# Altium schematic sheet Public_SOC.SchDoc
size Tabloid
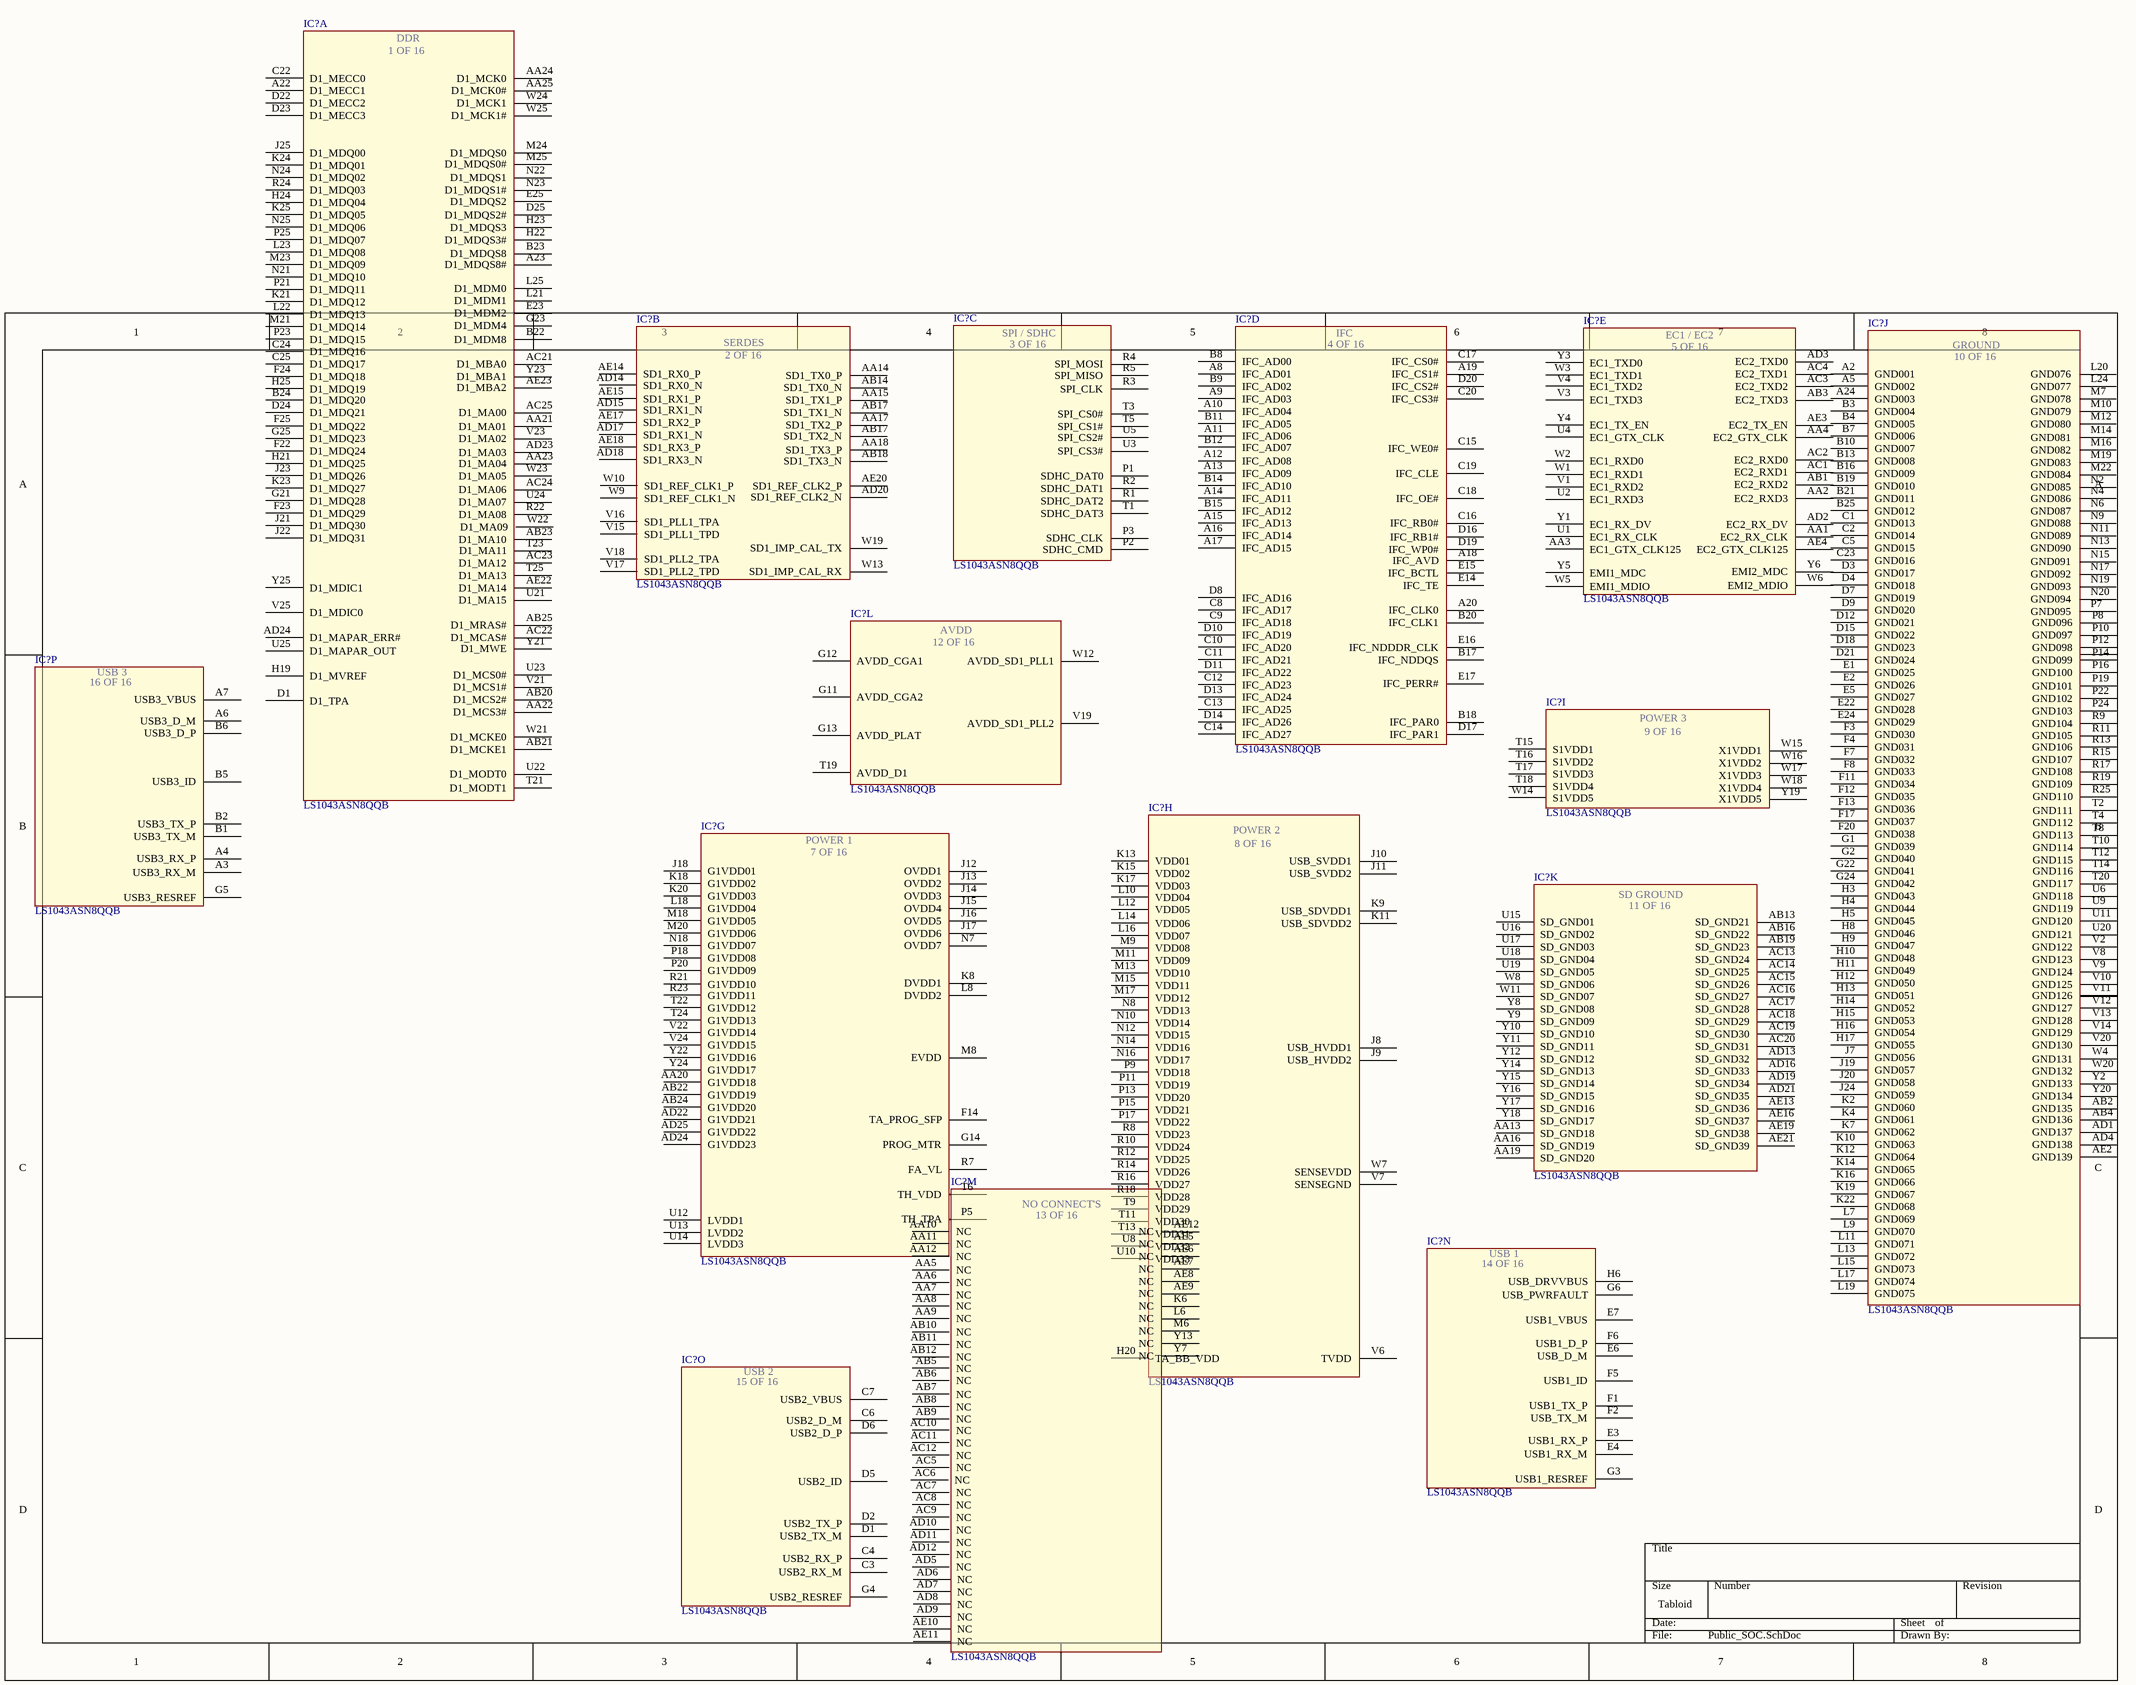
[diagram p0: Public_SOC.SchDoc]

## Parts
(Parts that share a designator on the sheet are numbered #1, #2 ... from top to bottom, then left to right.)
IC?#1  LS1043ASN8QQB  [BGA780C80P28X28_2300X2300X261]  (part E of 16)
IC?#2  LS1043ASN8QQB  [BGA780C80P28X28_2300X2300X261]  (part D of 16)
IC?#3  LS1043ASN8QQB  [BGA780C80P28X28_2300X2300X261]  (part L of 16)
IC?#4  LS1043ASN8QQB  [BGA780C80P28X28_2300X2300X261]  (part C of 16)
IC?#5  LS1043ASN8QQB  [BGA780C80P28X28_2300X2300X261]  (part I of 16)
IC?#6  LS1043ASN8QQB  [BGA780C80P28X28_2300X2300X261]  (part P of 16)
IC?#7  LS1043ASN8QQB  [BGA780C80P28X28_2300X2300X261]  (part K of 16)
IC?#8  LS1043ASN8QQB  [BGA780C80P28X28_2300X2300X261]  (part J of 16)
IC?#9  LS1043ASN8QQB  [BGA780C80P28X28_2300X2300X261]  (part A of 16)
IC?#10  LS1043ASN8QQB  [BGA780C80P28X28_2300X2300X261]  (part B of 16)
IC?#11  LS1043ASN8QQB  [BGA780C80P28X28_2300X2300X261]  (part G of 16)
IC?#12  LS1043ASN8QQB  [BGA780C80P28X28_2300X2300X261]  (part O of 16)
IC?#13  LS1043ASN8QQB  [BGA780C80P28X28_2300X2300X261]  (part H of 16)
IC?#14  LS1043ASN8QQB  [BGA780C80P28X28_2300X2300X261]  (part N of 16)
IC?#15  LS1043ASN8QQB  [BGA780C80P28X28_2300X2300X261]  (part M of 16)

## Nets

Not connected (* = marked no-connect by the designer): IC?#1 AA1(EC2_RX_CLK) AA2(EC2_RXD3) AA3(EC1_GTX_CLK125) AA4(EC2_GTX_CLK) AB1(EC2_RXD2) AB3(EC2_TXD3) AC1(EC2_RXD1) AC2(EC2_RXD0) AC3(EC2_TXD2) AC4(EC2_TXD1) AD2(EC2_RX_DV) AD3(EC2_TXD0) AE3(EC2_TX_EN) AE4(EC2_GTX_CLK125) U1(EC1_RX_CLK) U2(EC1_RXD3) U4(EC1_GTX_CLK) V1(EC1_RXD2) V3(EC1_TXD3) V4(EC1_TXD2) W1(EC1_RXD1) W2(EC1_RXD0) W3(EC1_TXD1) W5(EMI1_MDIO) W6(EMI2_MDIO) Y1(EC1_RX_DV) Y3(EC1_TXD0) Y4(EC1_TX_EN) Y5(EMI1_MDC) Y6(EMI2_MDC); IC?#2 A8(IFC_AD01) A9(IFC_AD03) A10(IFC_AD04) A11(IFC_AD06) A12(IFC_AD08) A13(IFC_AD09) A14(IFC_AD11) A15(IFC_AD13) A16(IFC_AD14) A17(IFC_AD15) A18(IFC_AVD) A19(IFC_CS1#) A20(IFC_CLK0) B8(IFC_AD00) B9(IFC_AD02) B11(IFC_AD05) B12(IFC_AD07) B14(IFC_AD10) B15(IFC_AD12) B17(IFC_NDDQS) B18(IFC_PAR0) B20(IFC_CLK1) C8(IFC_AD17) C9(IFC_AD18) C10(IFC_AD20) C11(IFC_AD21) C12(IFC_AD23) C13(IFC_AD25) C14(IFC_AD27) C15(IFC_WE0#) C16(IFC_RB0#) C17(IFC_CS0#) C18(IFC_OE#) C19(IFC_CLE) C20(IFC_CS3#) D8(IFC_AD16) D10(IFC_AD19) D11(IFC_AD22) D13(IFC_AD24) D14(IFC_AD26) D16(IFC_RB1#) D17(IFC_PAR1) D19(IFC_WP0#) D20(IFC_CS2#) E14(IFC_TE) E15(IFC_BCTL) E16(IFC_NDDDR_CLK) E17(IFC_PERR#); IC?#3 G11(AVDD_CGA2) G12(AVDD_CGA1) G13(AVDD_PLAT) T19(AVDD_D1) V19(AVDD_SD1_PLL2) W12(AVDD_SD1_PLL1); IC?#4 P1(SDHC_DAT0) P2(SDHC_CMD) P3(SDHC_CLK) R1(SDHC_DAT2) R2(SDHC_DAT1) R3(SPI_CLK) R4(SPI_MOSI) R5(SPI_MISO) T1(SDHC_DAT3) T3(SPI_CS0#) T5(SPI_CS1#) U3(SPI_CS3#) U5(SPI_CS2#); IC?#5 T15(S1VDD1) T16(S1VDD2) T17(S1VDD3) T18(S1VDD4) W14(S1VDD5) W15(X1VDD1) W16(X1VDD2) W17(X1VDD3) W18(X1VDD4) Y19(X1VDD5); IC?#6 A3(USB3_RX_M) A4(USB3_RX_P) A6(USB3_D_M) A7(USB3_VBUS) B1(USB3_TX_M) B2(USB3_TX_P) B5(USB3_ID) B6(USB3_D_P) G5(USB3_RESREF); IC?#7 AA13(SD_GND18) AA16(SD_GND19) AA19(SD_GND20) AB13(SD_GND21) AB16(SD_GND22) AB19(SD_GND23) AC13(SD_GND24) AC14(SD_GND25) AC15(SD_GND26) AC16(SD_GND27) AC17(SD_GND28) AC18(SD_GND29) AC19(SD_GND30) AC20(SD_GND31) AD13(SD_GND32) AD16(SD_GND33) AD19(SD_GND34) AD21(SD_GND35) AE13(SD_GND36) AE16(SD_GND37) AE19(SD_GND38) AE21(SD_GND39) U15(SD_GND01) U16(SD_GND02) U17(SD_GND03) U18(SD_GND04) U19(SD_GND05) W8(SD_GND06) W11(SD_GND07) Y8(SD_GND08) Y9(SD_GND09) Y10(SD_GND10) Y11(SD_GND11) Y12(SD_GND12) Y14(SD_GND13) Y15(SD_GND14) Y16(SD_GND15) Y17(SD_GND16) Y18(SD_GND17); IC?#8 A2(GND001) A5(GND002) A24(GND003) AB2(GND135) AB4(GND136) AD1(GND137) AD4(GND138) AE2(GND139) B3(GND004) B4(GND005) B7(GND006) B10(GND007) B13(GND008) B16(GND009) B19(GND010) B21(GND011) B25(GND012) C1(GND013) C2(GND014) C5(GND015) C23(GND016) D3(GND017) D4(GND018) D7(GND019) D9(GND020) D12(GND021) D15(GND022) D18(GND023) D21(GND024) E1(GND025) E2(GND026) E5(GND027) E22(GND028) E24(GND029) F3(GND030) F4(GND031) F7(GND032) F8(GND033) F11(GND034) F12(GND035) F13(GND036) F17(GND037) F20(GND038) G1(GND039) G2(GND040) G22(GND041) G24(GND042) H3(GND043) H4(GND044) H5(GND045) H8(GND046) H9(GND047) H10(GND048) H11(GND049) H12(GND050) H13(GND051) H14(GND052) H15(GND053) H16(GND054) H17(GND055) J7(GND056) J19(GND057) J20(GND058) J24(GND059) K2(GND060) K4(GND061) K7(GND062) K10(GND063) K12(GND064) K14(GND065) K16(GND066) K19(GND067) K22(GND068) L7(GND069) L9(GND070) L11(GND071) L13(GND072) L15(GND073) L17(GND074) L19(GND075) L20(GND076) L24(GND077) M7(GND078) M10(GND079) M12(GND080) M14(GND081) M16(GND082) M19(GND083) M22(GND084) N2(GND085) N4(GND086) N6(GND087) N9(GND088) N11(GND089) N13(GND090) N15(GND091) N17(GND092) N19(GND093) N20(GND094) P7(GND095) P8(GND096) P10(GND097) P12(GND098) P14(GND099) P16(GND100) P19(GND101) P22(GND102) P24(GND103) R9(GND104) R11(GND105) R13(GND106) R15(GND107) R17(GND108) R19(GND109) R25(GND110) T2(GND111) T4(GND112) T8(GND113) T10(GND114) T12(GND115) T14(GND116) T20(GND117) U6(GND118) U9(GND119) U11(GND120) U20(GND121) V2(GND122) V8(GND123) V9(GND124) V10(GND125) V11(GND126) V12(GND127) V13(GND128) V14(GND129) V20(GND130) W4(GND131) W20(GND132) Y2(GND133) Y20(GND134); IC?#9 A22(D1_MECC1) A23(D1_MDQS8#) AA21(D1_MA01) AA22(D1_MCS3#) AA23(D1_MA04) AA24(D1_MCK0) AA25(D1_MCK0#) AB20(D1_MCS2#) AB21(D1_MCKE1) AB23(D1_MA10) AB25(D1_MRAS#) AC21(D1_MBA0) AC22(D1_MCAS#) AC23(D1_MA12) AC24(D1_MA06) AC25(D1_MA00) AD23(D1_MA03) AD24(D1_MAPAR_ERR#) AE22(D1_MA14) AE23(D1_MBA2) B22(D1_MDM8) B23(D1_MDQS8) B24(D1_MDQ20) C22(D1_MECC0) C24(D1_MDQ16) C25(D1_MDQ17) D1(D1_TPA) D22(D1_MECC2) D23(D1_MECC3) D24(D1_MDQ21) D25(D1_MDQS2#) E23(D1_MDM2) E25(D1_MDQS2) F22(D1_MDQ24) F23(D1_MDQ29) F24(D1_MDQ18) F25(D1_MDQ22) G21(D1_MDQ28) G23(D1_MDM4) G25(D1_MDQ23) H19(D1_MVREF) H21(D1_MDQ25) H22(D1_MDQS3#) H23(D1_MDQS3) H24(D1_MDQ04) H25(D1_MDQ19) J21(D1_MDQ30) J22(D1_MDQ31) J23(D1_MDQ26) J25(D1_MDQ00) K21(D1_MDQ12) K23(D1_MDQ27) K24(D1_MDQ01) K25(D1_MDQ05) L21(D1_MDM1) L22(D1_MDQ13) L23(D1_MDQ08) L25(D1_MDM0) M21(D1_MDQ14) M23(D1_MDQ09) M24(D1_MDQS0) M25(D1_MDQS0#) N21(D1_MDQ10) N22(D1_MDQS1) N23(D1_MDQS1#) N24(D1_MDQ02) N25(D1_MDQ06) P21(D1_MDQ11) P23(D1_MDQ15) P25(D1_MDQ07) R22(D1_MA08) R24(D1_MDQ03) T21(D1_MODT1) T23(D1_MA11) T25(D1_MA13) U21(D1_MA15) U22(D1_MODT0) U23(D1_MCS0#) U24(D1_MA07) U25(D1_MAPAR_OUT) V21(D1_MCS1#) V23(D1_MA02) V25(D1_MDIC0) W21(D1_MCKE0) W22(D1_MA09) W23(D1_MA05) W24(D1_MCK1) W25(D1_MCK1#) Y21(D1_MWE) Y23(D1_MBA1) Y25(D1_MDIC1); IC?#10 AA14(SD1_TX0_P) AA15(SD1_TX1_P) AA17(SD1_TX2_P) AA18(SD1_TX3_P) AB14(SD1_TX0_N) AB17(SD1_TX1_N) AB18(SD1_TX3_N) AD14(SD1_RX0_N) AD15(SD1_RX1_N) AD17(SD1_RX1_N) AD18(SD1_RX3_N) AD20(SD1_REF_CLK2_N) AE14(SD1_RX0_P) AE15(SD1_RX1_P) AE17(SD1_RX2_P) AE18(SD1_RX3_P) AE20(SD1_REF_CLK2_P) V15(SD1_PLL1_TPD) V16(SD1_PLL1_TPA) V17(SD1_PLL2_TPD) V18(SD1_PLL2_TPA) W9(SD1_REF_CLK1_N) W10(SD1_REF_CLK1_P) W13(SD1_IMP_CAL_RX) W19(SD1_IMP_CAL_TX); IC?#11 AA20(G1VDD18) AB22(G1VDD19) AB24(G1VDD20) AD22(G1VDD21) AD24(G1VDD23) AD25(G1VDD22) F14(TA_PROG_SFP) G14(PROG_MTR) J12(OVDD1) J13(OVDD2) J14(OVDD3) J15(OVDD4) J16(OVDD5) J17(OVDD6) J18(G1VDD01) K8(DVDD1) K18(G1VDD02) K20(G1VDD03) L8(DVDD2) L18(G1VDD04) M8(EVDD) M18(G1VDD05) M20(G1VDD06) N7(OVDD7) N18(G1VDD07) P5(TH_TPA) P18(G1VDD08) P20(G1VDD09) R7(FA_VL) R21(G1VDD10) R23(G1VDD11) T6(TH_VDD) T22(G1VDD12) T24(G1VDD13) U12(LVDD1) U13(LVDD2) U14(LVDD3) V22(G1VDD14) V24(G1VDD15) Y22(G1VDD16) Y24(G1VDD17); IC?#12 C3(USB2_RX_M) C4(USB2_RX_P) C6(USB2_D_M) C7(USB2_VBUS) D1(USB2_TX_M) D2(USB2_TX_P) D5(USB2_ID) D6(USB2_D_P) G4(USB2_RESREF); IC?#13 H20(TA_BB_VDD) J8(USB_HVDD1) J9(USB_HVDD2) J10(USB_SVDD1) J11(USB_SVDD2) K9(USB_SDVDD1) K11(USB_SDVDD2) K13(VDD01) K15(VDD02) K17(VDD03) L10(VDD04) L12(VDD05) L14(VDD06) L16(VDD07) M9(VDD08) M11(VDD09) M13(VDD10) M15(VDD11) M17(VDD12) N8(VDD13) N10(VDD14) N12(VDD15) N14(VDD16) N16(VDD17) P9(VDD18) P11(VDD19) P13(VDD20) P15(VDD21) P17(VDD22) R8(VDD23) R10(VDD24) R12(VDD25) R14(VDD26) R16(VDD27) R18(VDD28) T9(VDD29) T11(VDD30) T13(VDD31) U8(VDD32) U10(VDD33) V6(TVDD) V7(SENSEGND) W7(SENSEVDD); IC?#14 E3(USB1_RX_P) E4(USB1_RX_M) E6(USB_D_M) E7(USB1_VBUS) F1(USB1_TX_P) F2(USB_TX_M) F5(USB1_ID) F6(USB1_D_P) G3(USB1_RESREF) G6(USB_PWRFAULT) H6(USB_DRVVBUS); IC?#15 AA5(NC) AA6(NC) AA7(NC) AA8(NC) AA9(NC) AA10(NC) AA11(NC) AA12(NC) AB5(NC) AB6(NC) AB7(NC) AB8(NC) AB9(NC) AB10(NC) AB11(NC) AB12(NC) AC5(NC) AC6(NC) AC7(NC) AC8(NC) AC9(NC) AC10(NC) AC11(NC) AC12(NC) AD5(NC) AD6(NC) AD7(NC) AD8(NC) AD9(NC) AD10(NC) AD11(NC) AD12(NC) AE5(NC) AE6(NC) AE7(NC) AE8(NC) AE9(NC) AE10(NC) AE11(NC) AE12(NC) K6(NC) L6(NC) M6(NC) Y7(NC) Y13(NC)

## Notes on the sheet
- (in symbol LS1043ASN8QQB, part A) DDR; 1 OF 16
- (in symbol LS1043ASN8QQB, part B) SERDES; 2 OF 16
- (in symbol LS1043ASN8QQB, part C) SPI / SDHC; 3 OF 16
- (in symbol LS1043ASN8QQB, part D) IFC; 4 OF 16
- (in symbol LS1043ASN8QQB, part E) EC1 / EC2; 5 OF 16
- (in symbol LS1043ASN8QQB, part G) POWER 1; 7 OF 16
- (in symbol LS1043ASN8QQB, part H) POWER 2; 8 OF 16
- (in symbol LS1043ASN8QQB, part I) POWER 3; 9 OF 16
- (in symbol LS1043ASN8QQB, part J) GROUND; 10 OF 16
- (in symbol LS1043ASN8QQB, part K) SD GROUND; 11 OF 16
- (in symbol LS1043ASN8QQB, part L) AVDD; 12 OF 16
- (in symbol LS1043ASN8QQB, part M) NO CONNECT'S; 13 OF 16
- (in symbol LS1043ASN8QQB, part N) USB 1; 14 OF 16
- (in symbol LS1043ASN8QQB, part O) USB 2; 15 OF 16
- (in symbol LS1043ASN8QQB, part P) USB 3; 16 OF 16

## Library data of the parts
IC?#1-IC?#15 = LS1043ASN8QQB: Integrated Circuit; Manufacturer_Name: NXP; Datasheet Link: http://www.nxp.com/secured/assets/documents/en/data-sheet/LS1088A.pdf; Height: 2.61mm; Manufacturer_Part_Number: LS1043ASN8QQB; Mouser Part Number: 771-LS1043ASN8QQB; Mouser Price/Stock: https://www.mouser.co.uk/ProductDetail/NXP-Semiconductors/LS1043ASN8QQB/?qs=AQlKX63v8RsTATOTx7X0Jg%3D%3D